# Altium schematic sheet 2019-10-29_14-21-201.schdoc
size 340 x 111 mm; SheetNumber: 1; SheetTotal: 1
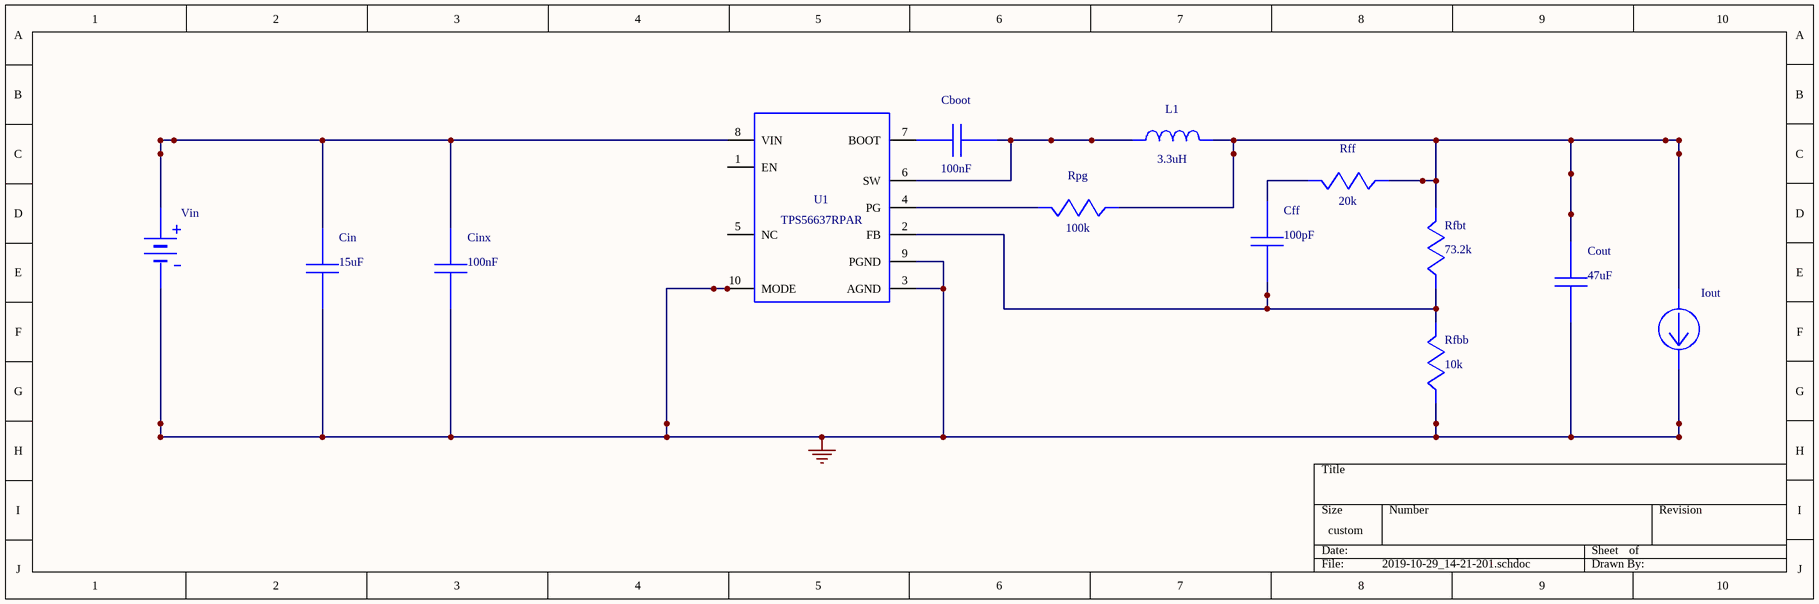
[diagram p0: 2019-10-29_14-21-201.schdoc]

## Parts
Cboot  value 100nF  (hidden comment: C0805C104M5RACTU)
Cff  value 100pF  (hidden comment: GQM2195C1H101JB01D)
Cin  value 15uF  (hidden comment: C2012X5R1V156M125AC)
Cinx  value 100nF  (hidden comment: GRM21BR71H104KA01L)
Cout  value 47uF  (hidden comment: GRM31CR61A476KE15L)
Iout  WB_CURRENT_LOAD  (value not drawn)
L1  value 3.3uH  (hidden comment: IHLP3232DZER3R3M01)
Rfbb  value 10k  (hidden comment: CRCW080510K0FKEA)
Rfbt  value 73.2k  (hidden comment: CRCW080573K2FKEA)
Rff  value 20k  (hidden comment: CRCW080520K0FKEA)
Rpg  value 100k  (hidden comment: CRCW0805100KFKEA)
U1  TPS56637RPAR
Vin  WB_BATTERY  (value not drawn)

## Nets
0: Cin.2 Cinx.2 Cout.2 Iout.2(-) Rfbb.2 U1.3(AGND) U1.9(PGND) U1.10(MODE) Vin.2(-)
NetCboot_1: Cboot.1 U1.7(BOOT)
NetCboot_2: Cboot.2 L1.1 U1.6(SW)
NetCff_1: Cff.1 Rff.1
NetCff_2: Cff.2 Rfbb.1 Rfbt.2 U1.2(FB)
NetCin_1: Cin.1 Cinx.1 U1.8(VIN) Vin.1(+)
NetCout_1: Cout.1 Iout.1(+) L1.2 Rfbt.1 Rff.2 Rpg.2
NetRpg_1: Rpg.1 U1.4(PG)

Not connected (* = marked no-connect by the designer): U1 1(EN) 5(NC)

## Library data of the parts
Cboot = C0805C104M5RACTU: Manufacturer Name: Kemet; PackageReference: C0805C104M5RACTU; Manufacturer Part Number: C0805C104M5RACTU
Cff = GQM2195C1H101JB01D: GQM2195C1H101JB0; Manufacturer Name: MuRata; PackageReference: GQM2195C1H101JB01D; Manufacturer Part Number: GQM2195C1H101JB01D
Cin = C2012X5R1V156M125AC: C2012X5R1V156M12; Manufacturer Name: TDK; PackageReference: C2012X5R1V156M125AC; Manufacturer Part Number: C2012X5R1V156M125AC
Cinx = GRM21BR71H104KA01L: GRM21BR71H104KA0; Manufacturer Name: MuRata; PackageReference: GRM21BR71H104KA01L; Manufacturer Part Number: GRM21BR71H104KA01L
Cout = GRM31CR61A476KE15L: GRM31CR61A476KE1; Manufacturer Name: MuRata; PackageReference: GRM31CR61A476KE15L; Manufacturer Part Number: GRM31CR61A476KE15L
L1 = IHLP3232DZER3R3M01: Unknown; Manufacturer Name: Vishay-Dale; PackageReference: IHLP3232DZER3R3M01; Manufacturer Part Number: IHLP3232DZER3R3M01
Rfbb = CRCW080510K0FKEA: Manufacturer Name: Vishay-Dale; PackageReference: CRCW080510K0FKEA; Manufacturer Part Number: CRCW080510K0FKEA
Rfbt = CRCW080573K2FKEA: Manufacturer Name: Vishay-Dale; PackageReference: CRCW080573K2FKEA; Manufacturer Part Number: CRCW080573K2FKEA
Rff = CRCW080520K0FKEA: Manufacturer Name: Vishay-Dale; PackageReference: CRCW080520K0FKEA; Manufacturer Part Number: CRCW080520K0FKEA
Rpg = CRCW0805100KFKEA: Manufacturer Name: Vishay-Dale; PackageReference: CRCW0805100KFKEA; Manufacturer Part Number: CRCW0805100KFKEA
U1 = TPS56637RPAR: Manufacturer Name: Texas Instruments; PackageReference: TPS56637RPAR; Manufacturer Part Number: TPS56637RPAR; Value: N/A
Iout = WB_CURRENT_LOAD: PackageReference: WB_CURRENT_LOAD; Manufacturer Part Number: WB_CURRENT_LOAD; Manufacturer Name: WB_CURRENT_LOAD; Value: N/A
Vin = WB_BATTERY: PackageReference: WB_BATTERY; Manufacturer Part Number: WB_BATTERY; Manufacturer Name: WB_BATTERY; Value: N/A